# EAGLE design Jacks_EDCPSU_v5 (EAGLE 9.6.2)
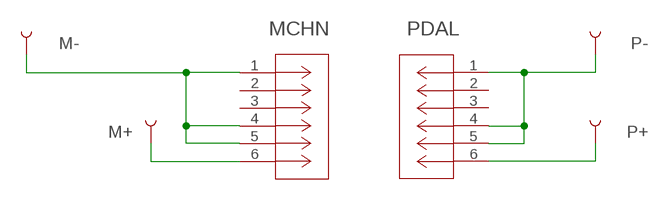
[diagram p0: schematic, sheet 1]

## Parts
M+  TEST-POINT3  [PAD.03X.03]
M-  TEST-POINT3  [PAD.03X.03]
MCHN  ACJS-MHDR  [CONN_MHDR_AMP]
P+  TEST-POINT3  [PAD.03X.03]
P-  TEST-POINT3  [PAD.03X.03]
PDAL  ACJS-MHDR  [CONN_MHDR_AMP]

## Nets
N$1: P-.P$1 PDAL.1 PDAL.4 PDAL.5
N$2: P+.P$1 PDAL.6
N$3: M-.P$1 MCHN.1 MCHN.4 MCHN.5
N$4: M+.P$1 MCHN.6
Unconnected: MCHN.2 MCHN.3 PDAL.2 PDAL.3

## Library data of the parts
M+ M- P+ P- = SparkFun-Connectors:TEST-POINT: SparkFun Test Points Bare copper test points for troubleshooting or In-Circuit-Testing. These are used by our Production team for verifying production board runs using pogo-pins on test beds. SparkFun Products: SparkFun LSM9DS1 Breakout <https://www.sparkfun.com/products/13284> SparkFun PSOC <https://www.sparkfun.com/products/13714> SparkFun Load Cell Amplifier <https://www.sparkfun.com/products/13879>
MCHN PDAL = ACJSMHDR_JACK:ACJS-MHDR; BUILT_BY: EMA_Matt; COPYRIGHT: Copyright (C) 2018 Accelerated Designs. All rights reserved; MANUFACTURER_PART_NUMBER: ACJS-MHDR; SOURCELIBRARY: Amphenol_2019-10-30; VENDOR: Amphenol

## Board
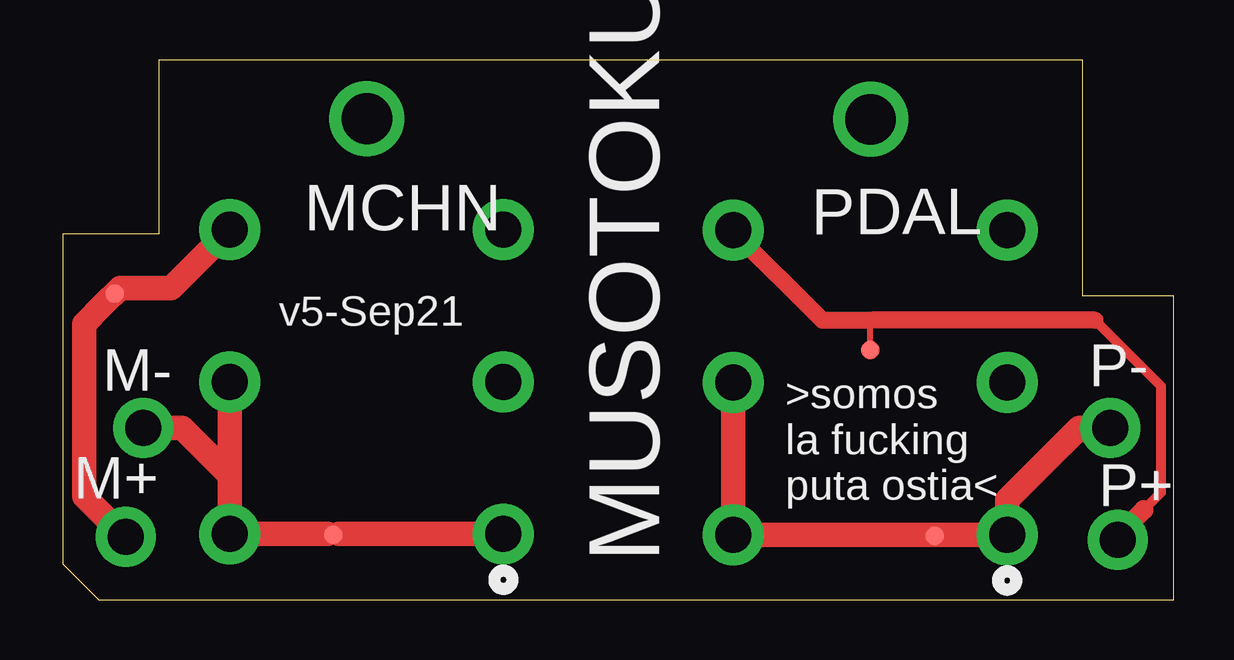
[diagram p1: board, top side]
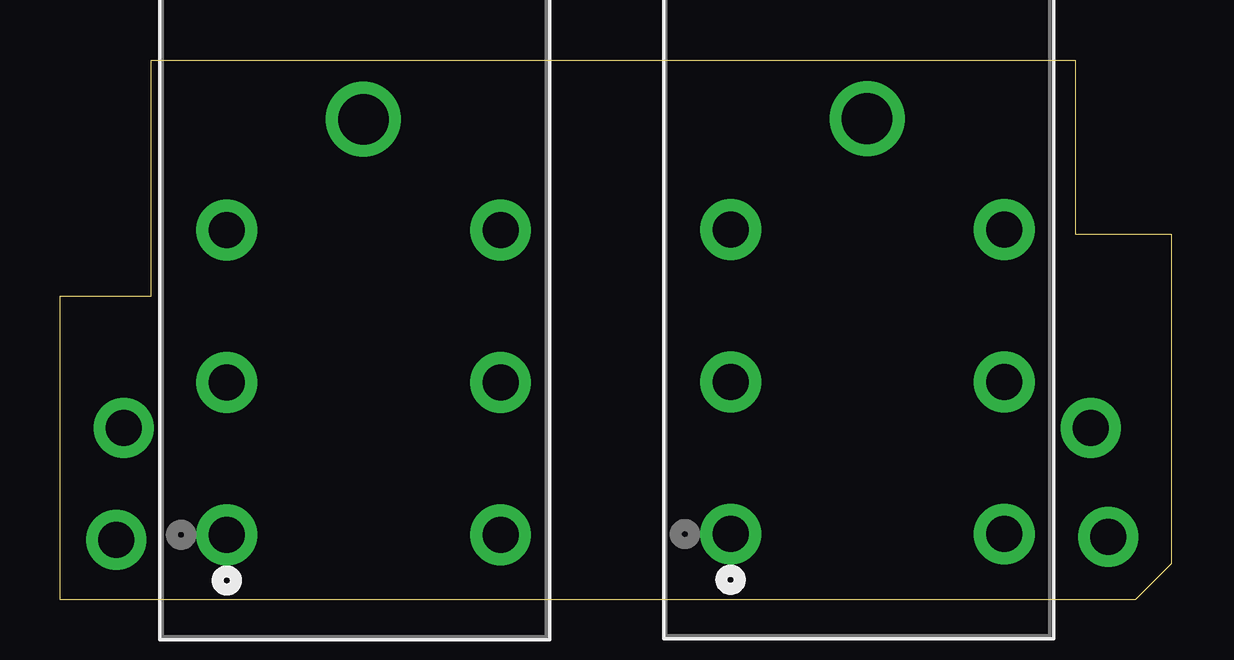
[diagram p2: board, bottom side, seen from below]

Size 46.3 x 22.5 mm. Coordinates in mm from the lower left corner, seen from the top.
Outline: 4,22.5 4,15.25 0,15.25 0,1.5 1.5,0 46.3,0 46.3,12.65 42.5,12.65 42.5,22.5 4,22.5
Copper layers (1*16): Top 0.035mm / dielectric 1.5mm / Bottom 0.035mm
Design rules "default *": minimum track width 6mil, minimum drill 0.35mm, track to track 6mil, track to pad 6mil, pad to pad 6mil, via to via 6mil, smd to smd 6mil, copper to edge 12mil, drill to drill 6mil, minimum pad ring 10mil, minimum via ring 8mil, stop-mask expansion 4mil, vias tented up to drill 0mil, thermal gap 10mil

### Footprints (pad centres in the part's own frame; a part is rotated, then mirrored left to right if it is on the bottom)
PAD.03X.03 = smd 0.762 x 0.762: P$1 0,0
CONN_MHDR_AMP = drill 1.5 pad 2.54: 1 0,0; 2 -6.35,0; 3 -12.7,0; 4 0,11.405; 5 -6.35,11.405; 6 -12.7,11.405 | drill 2.108 pad 2.616: 7 -17.323,5.69

### Placement (x,y rotation side)
M+  2.16,12.76 0 top
M-  11.26,2.69 0 top
MCHN  18.36,2.73 270 bottom
P+  33.65,10.4 0 top
P-  36.33,2.66 0 top
PDAL  39.35,2.7 270 bottom

### Tracks (layer width: path | path; a pad name or v marks a point on that pad's centre or on a via)
N$1  (via drill 1.5 pad 2.5)
  Top 0.254: 36.45,2.7 36.37,2.7 P-.P$1
  Top 1.016: v43.65,7.15 42.35,7.15 39.35,4.15 PDAL.1 36.45,2.7 PDAL.4 PDAL.5
N$2  (via drill 1.5 pad 2.5)
  Top 0.254: P+.P$1 33.65,11.6 33.7,11.65
  Top 0.406: 43,11.65 45.75,8.9 45.75,4.45 45.05,3.75
  Top 0.7: 27.95,15.35 31.65,11.65 33.7,11.65 43,11.65
  Top 0.813: v43.95,2.5 43.95,2.65 45.05,3.75
  Top 1.016: PDAL.6 27.95,15.35
N$3  (via drill 1.5 pad 2.5)
  Top 0.152: 11.5,2.73 11.26,2.73 11.05,2.73
  Top 0.254: M-.P$1 11.26,2.73
  Top 1.016: MCHN.4 11.05,2.73 | MCHN.1 11.5,2.73 | MCHN.4 6.95,5.18 4.98,7.15 v3.35,7.15 | MCHN.5 MCHN.4
N$4  (via drill 1.5 pad 2.5)
  Top 0.254: M+.P$1 1.68,12.27
  Top 1.016: 7.55,15.43 MCHN.6 4.52,13 2.4,13 1.68,12.27 0.9,11.5 0.9,4.3 2.6,2.6 v2.62,2.62

### Text on the board
tPlace: v5-Sep21 | M- | P- | M+ | >somos / la fucking / puta ostia< | P+ | MUSOTOKU